# EAGLE design Zio 9DOF IMU BNO055 (EAGLE 8.4.1)
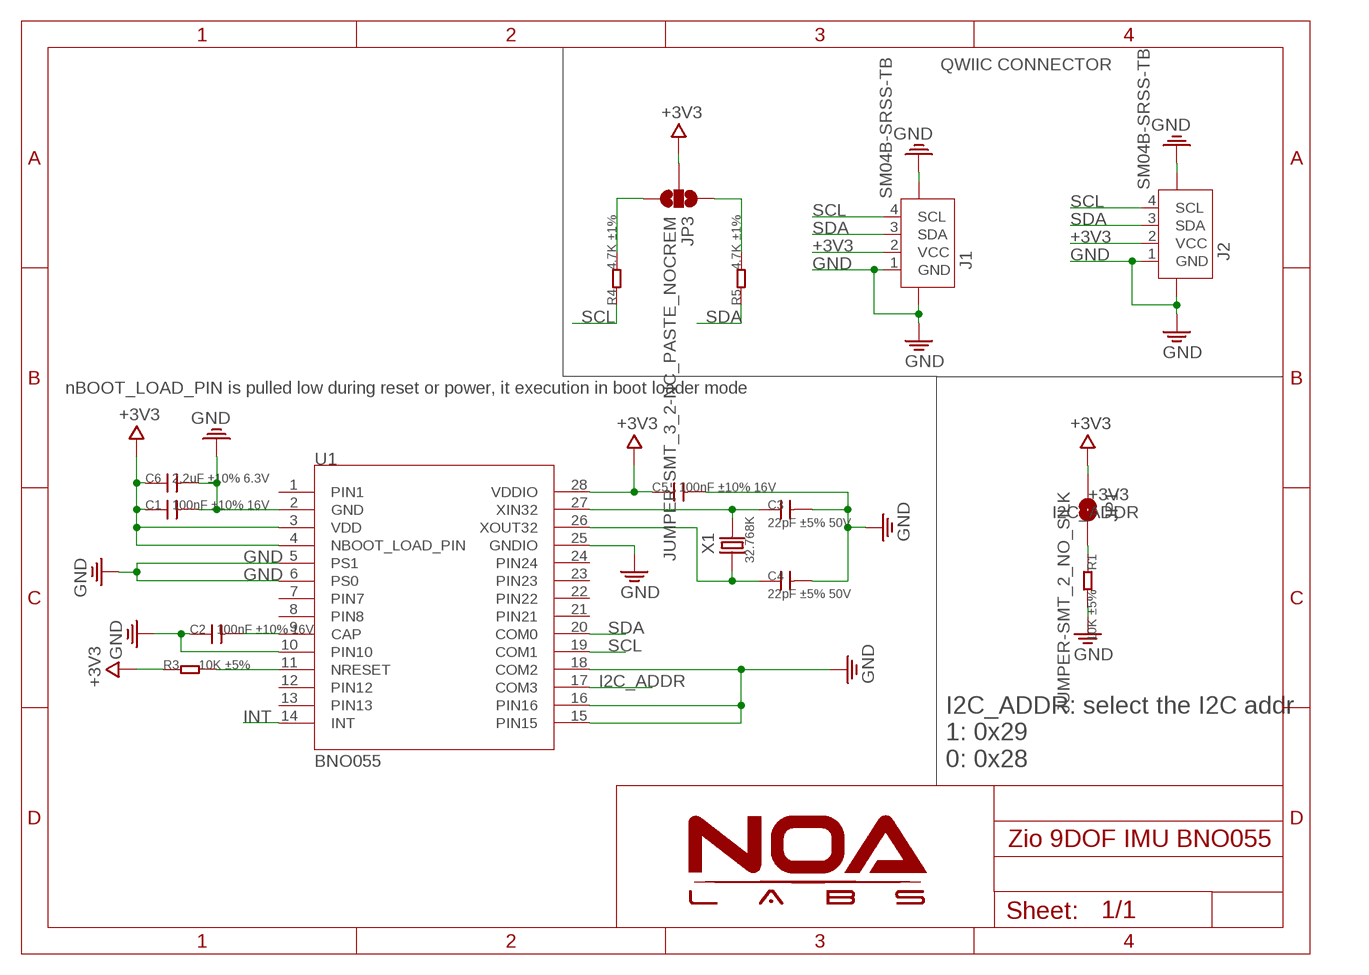
[diagram p0: schematic, sheet 1]

## Parts
C1  100nF ±10% 16V  C-0402  [0402]
C2  100nF ±10% 16V  C-0402  [0402]
C3  22pF ±5% 50V  C-0402  [0402]
C4  22pF ±5% 50V  C-0402  [0402]
C5  100nF ±10% 16V  C-0402  [0402]
C6  2.2uF ±10% 6.3V  C-0402  [0402]
J1  SM04B-SRSS-TB  JST-SH-4P-1.0  [JST-SH-4P]
J2  SM04B-SRSS-TB  JST-SH-4P-1.0  [JST-SH-4P]
JP1  JUMPER-SMT_2_NO_SILK  [SMT-JUMPER_2_NO_SILK]
JP3  JUMPER-SMT_3_2-NC_PASTE_NOCREM  [SMT-JUMPER_3_2-NC_PASTE_SILK_NOCREM]
R1  10K ±5%  R-0402  [0402]
R3  10K ±5%  R-0402  [0402]
R4  4.7K ±1%  R-0402  [0402]
R5  4.7K ±1%  R-0402  [0402]
U1  BNO055  [LGA-28_3.80X5.20/0.5]
X1  32.768K  CRYSTAL-2012  [2.0X12MM]

## Nets
+3V3: C1.1 C5.1 C6.1 J1.2(VCC) J2.2(VCC) JP1.1 JP3.2 R3.1 U1.3(VDD) U1.4(NBOOT_LOAD_PIN) U1.28(VDDIO)
GND: C1.2 C2.1 C3.2 C4.2 C5.2 C6.2 J1.1(GND) J1.NC1 J1.NC2 J2.1(GND) J2.NC1 J2.NC2 R1.2 U1.2(GND) U1.5(PS1) U1.6(PS0) U1.10(PIN10) U1.15(PIN15) U1.16(PIN16) U1.18(COM2) U1.25(GNDIO)
I2C_ADDR: JP1.2 R1.1 U1.17(COM3)
INT: U1.14(INT)
N$1: C2.2 U1.9(CAP)
N$3: R3.2 U1.11(NRESET)
N$4: C3.1 U1.27(XIN32) X1.2
N$5: C4.1 U1.26(XOUT32) X1.1
N$19: JP3.3 R4.2
N$20: JP3.1 R5.2
SCL: J1.4(SCL) J2.4(SCL) R4.1 U1.19(COM1)
SDA: J1.3(SDA) J2.3(SDA) R5.1 U1.20(COM0)
Unconnected: U1.1(PIN1) U1.7(PIN7) U1.8(PIN8) U1.12(PIN12) U1.13(PIN13) U1.21(PIN21) U1.22(PIN22) U1.23(PIN23) U1.24(PIN24)

## Notes on the sheet
- QWIIC CONNECTOR
- nBOOT_LOAD_PIN is pulled low during reset or power, it execution in boot loader mode
- I2C_ADDR: select the I2C addr
  1: 0x29 
  0: 0x28

## Library data of the parts
C1-C6 = Discrete:C*: Ceramic Capacitors
J1 J2 = Connector:JST-SH-4P
JP1 = SparkFun-Jumpers:JUMPER-SMT_2_NO: Normally open jumper This jumper has two pads in close proximity to each other. Apply solder to close the connection. Round pads are easier to solder for beginners, but are a lot larger. SparkFun Product that uses the round pads: SparkFun EL Sequencer <https://www.sparkfun.com/products/12781>
JP3 = NOA-Jumpers:JUMPER-SMT_3_2-NC_PASTE_NOCREM
R1 R3 = Discrete:R*
R4 R5 = Discretex:R*
U1 = IC:BNO055
X1 = Discrete:CRYSTAL*: CRYSTAL

## Board
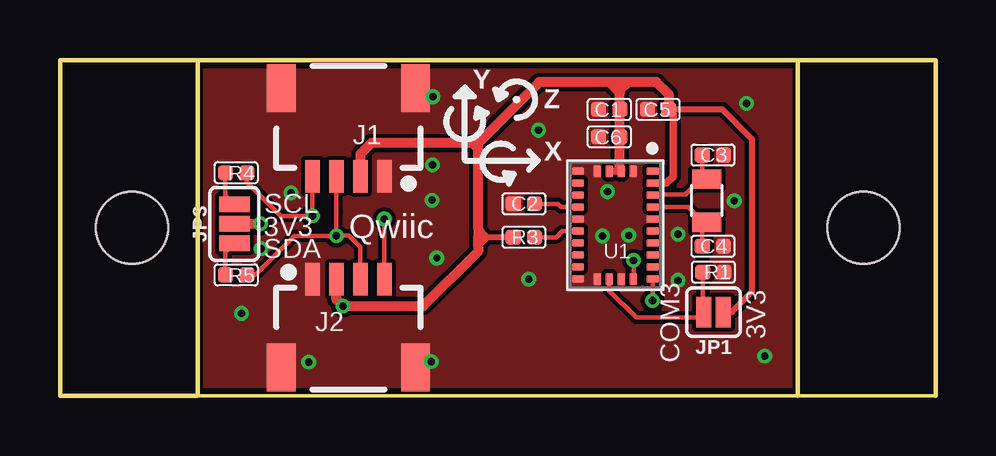
[diagram p1: board, top side]
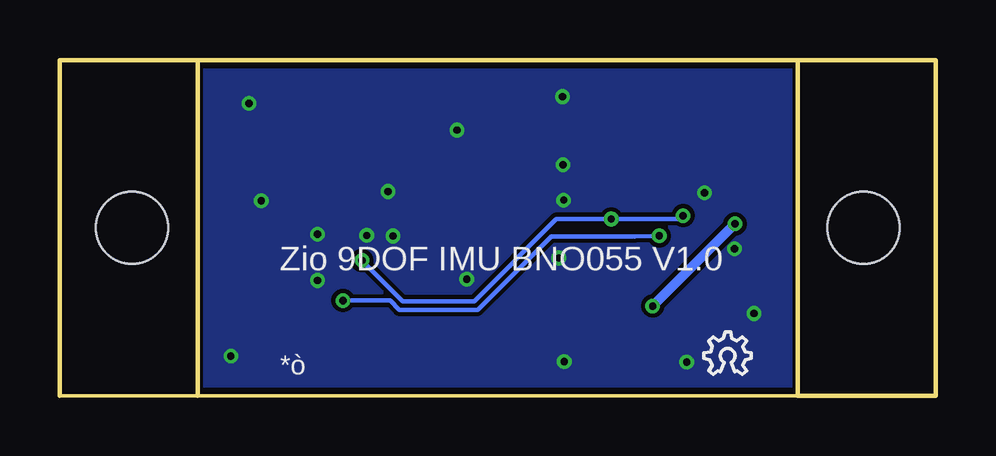
[diagram p2: board, bottom side, seen from below]

Size 36.48 x 14 mm. Coordinates in mm from the lower left corner, seen from the top.
Outline: 5.74,0 36.48,0 36.48,14 0,14 0,0 5.74,0
Copper layers (1*16): Top 0.035mm / dielectric 1.5mm / Bottom 0.035mm
Design rules "NOA Eagle Rule *": minimum track width 7mil, minimum drill 12mil, track to track 7mil, track to pad 7mil, pad to pad 7mil, via to via 7mil, smd to smd 0mil, copper to edge 10mil, drill to drill 10mil, minimum pad ring 10mil, minimum via ring 6mil, stop-mask expansion 2mil, vias tented up to drill 25mil, thermal gap 10mil
Holes 3 mm at 3,7 33.48,7
Milling: 2 lines

### Footprints (pad centres in the part's own frame; a part is rotated, then mirrored left to right if it is on the bottom)
0402 = smd 0.635 x 0.635: 1 -0.445,0; 2 0.445,0
JST-SH-4P = smd 0.6 x 1.35: 1 1.5,0; 2 0.5,0; 3 -0.5,0; 4 -1.5,0 | smd 1.2 x 2: NC1 -2.8,3.675; NC2 2.8,3.675
SMT-JUMPER_2_NO_SILK = smd 0.635 x 1.27: 1 -0.406,0; 2 0.406,0
SMT-JUMPER_3_2-NC_PASTE_SILK_NOCREM = smd 0.635 x 1.27: 1 -0.813,0; 2 0,0; 3 0.813,0
LGA-28_3.80X5.20/0.5 = smd 0.3 x 0.5: 1 -2.25,1.56; 6 -2.25,-1.56; 7 -1.75,-1.56; 8 -1.25,-1.56; 9 -0.75,-1.56; 10 -0.25,-1.56; 11 0.25,-1.56; 12 0.75,-1.56; 13 1.25,-1.56; 14 1.75,-1.56; 15 2.25,-1.56; 20 2.25,1.56; 21 1.75,1.56; 22 1.25,1.56; 23 0.75,1.56; 24 0.25,1.56; 25 -0.25,1.56; 26 -0.75,1.56; 27 -1.25,1.56; 28 -1.75,1.56 | smd 0.5 x 0.3: 2 -2.25,0.75; 3 -2.25,0.25; 4 -2.25,-0.25; 5 -2.25,-0.75; 16 2.25,-0.75; 17 2.25,-0.25; 18 2.25,0.25; 19 2.25,0.75
2.0X12MM = smd 0.8 x 1.2: 1 -0.9,0; 2 0.9,0

### Placement (x,y rotation side)
C1  22.88,11.94 180 top
C2  19.33,8 0 top
C3  27.2,10.03 0 top
C4  27.2,6.22 0 top
C5  24.92,11.94 180 top
C6  22.88,10.79 180 top
E$3  [6MM]  23.29,10.21 0 bottom
J1  12.01,9.14 0 top
J2  12.01,4.85 180 top
JP1  27.23,3.48 180 top
JP3  7.26,7.16 90 top
LOGO2  LOGO-OSHW-6MILX0070-NT  [OSHW_6X70_NOTEXT]  9.65,0.88 0 bottom
R1  27.23,5.15 0 top
R3  19.33,6.6 0 top
R4  7.34,9.3 180 top
R5  7.34,5.03 180 top
U1  23.14,7.11 270 top
U$6  [6MM]  16.71,0.43 0 top
X1  26.95,8.13 90 top

### Tracks (layer width: path | path; a pad name or v marks a point on that pad's centre or on a via)
+3V3  (via drill 0.3)
  Top 0.178: U1.3 23.33,9.42
  Top 0.254: 25.14,8.86 U1.28 | JP1.1 27.99,3.48 28.83,4.32 28.83,10.69 27.58,11.94 C5.1 | R3.1 17.8,6.6 | 17.8,6.6 17.42,6.6 | 17.8,6.6 17.42,6.99 | 17.8,6.6 17.42,6.22
  Top 0.305: U1.4 U1.3 | U1.28 25.27,8.86 25.55,9.14 25.55,11.75 C5.1
  Top 0.406: C6.1 C1.1 | C1.1 23.33,12.64 22.88,13.08 | 22.88,13.08 19.96,13.08 17.42,10.54 | 23.39,10.74 C6.1 | C6.1 23.33,9.42 23.36,9.39 | 23.67,13.08 24.85,13.08 25.36,12.57 C5.1 | 23.67,13.08 22.88,13.08 | C1.1 23.33,12.74 23.67,13.08 | 17.2,10.54 17.42,10.54 | 17.2,10.54 12.98,10.54 12.52,10.08 12.52,8.83 12.51,8.84 J1.2 | 17.42,10.31 17.42,6.99 17.42,6.6 17.42,6.22 17.42,6.02 15.14,3.73 v11.79,3.73 11.51,4 J2.2 | 17.42,10.31 17.42,10.54 | 17.42,10.31 17.2,10.54 | v8.36,7.16 JP3.2
  Bottom 0.406: v8.36,7.16 v11.79,3.73
GND  (via drill 0.3)
  other vias: 10.36,1.4 7.57,3.43 28.6,12.19 28.09,8.13 15.54,12.47 19.94,11.07 29.36,1.65 19.53,4.85 9.63,8.46 15.49,8.15 25.76,6.73 23.7,6.68 22.61,6.65 22.81,8.51 15.52,9.63 15.47,1.42 8.38,6.12 15.7,5.74 25.76,4.8
  pour Top (no thermals): 6.04,0 30.44,0 30.44,14 6.04,14
  pour Bottom (no thermals): 6.04,0 30.44,0 30.44,14 6.04,14
I2C_ADDR
  Top 0.178: R1.1 26.78,3.52 JP1.2 26.59,3.25 24,3.25 22.89,4.37 U1.17
N$1
  Top 0.178: U1.9 20.88,7.86 20.74,8 C2.2
N$3
  Top 0.178: U1.11 20.93,6.86 20.68,6.6 R3.2
N$4
  Top 0.178: 26.79,9.03 X1.2 | 26.79,9.03 26.71,9.03 26.06,8.38 24.72,8.38 U1.27 | C3.1 26.76,9.06 26.79,9.03
N$5
  Top 0.178: U1.26 24.71,7.87 26.19,7.87 26.83,7.23 X1.1 26.76,7.04 C4.1
N$19
  Top 0.178: R4.2 6.9,8.34 JP3.3
N$20
  Top 0.178: JP3.1 6.9,5.98 R5.2
SCL  (via drill 0.3)
  Top 0.178: U1.19 23.9,4.87 v23.9,5.64 | v13.51,7.37 13.51,5.56 | 10.52,8.82 10.52,8.41 | 10.52,8.41 v10.52,7.5 10.5,7.49 9.19,7.49 7.79,8.9 R4.1 | 13.51,5.56 13.51,5.18 | 10.52,8.41 J1.4 | 13.51,5.56 J2.4
  Bottom 0.178: v23.9,5.64 22.2,3.94 19.23,3.94 15.8,7.37 v13.51,7.37 10.65,7.37 v10.52,7.5
SDA  (via drill 0.3)
  Top 0.178: U1.20 24.7,3.97 v24.69,3.96 | 11.51,6.68 11.51,7.66 J1.3 | 11.51,6.68 v11.51,6.66 9.76,6.66 8.13,5.03 R5.1 | 11.51,6.68 12.04,6.68 12.51,6.21 J2.3
  Bottom 0.178: v24.69,3.96 22.73,3.96 22.35,3.58 19.08,3.58 16.02,6.64 12.53,6.64 v11.51,6.66

### Text on the board
tPlace: Y | Z | X | SCL | 3V3 | Qwiic | SDA | 3V3 | COM3
bPlace: Zio 9DOF IMU BNO055 V1.0 | *ò